# EAGLE design windowSensor (EAGLE 7.4.0)
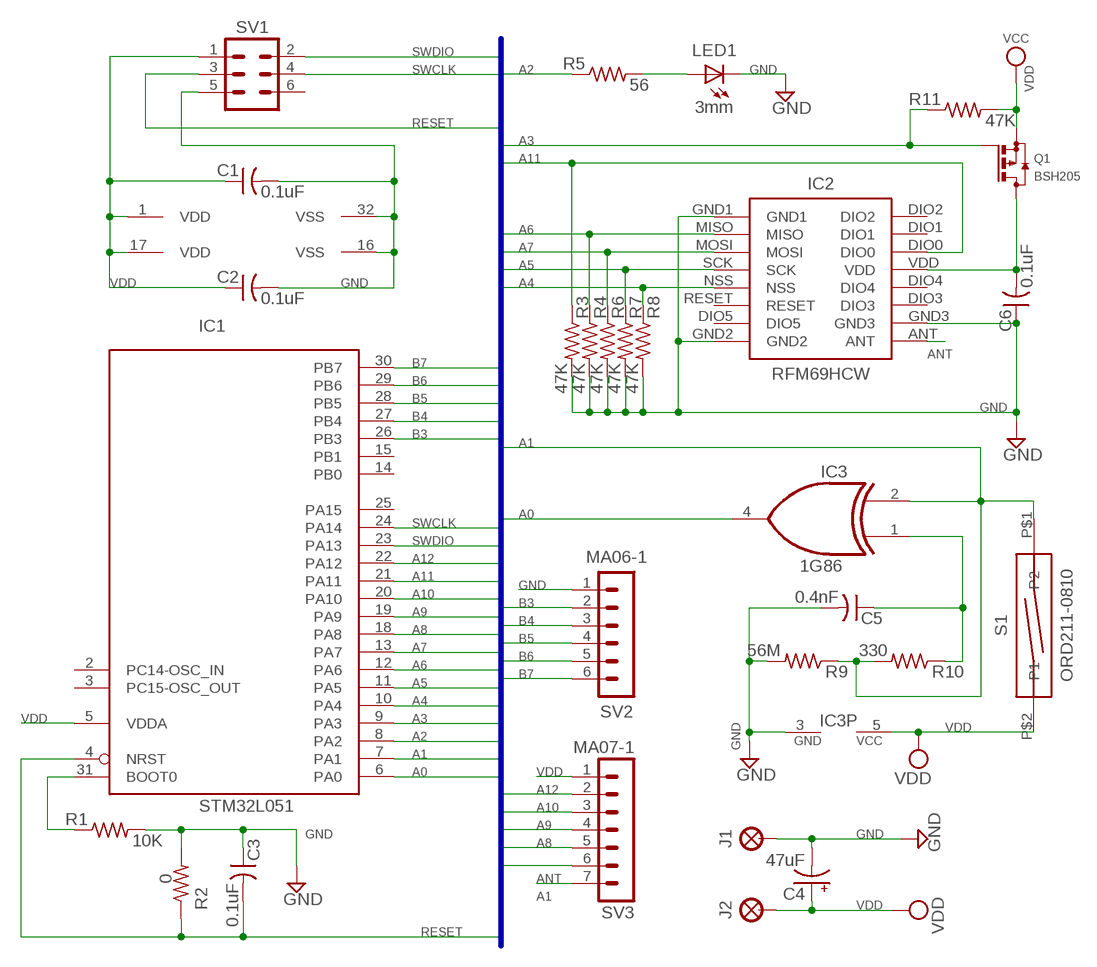
[diagram p0: schematic, sheet 1]

## Parts
C1  0.1uF  C-US0805  [C0805]
C2  0.1uF  C-US0805  [C0805]
C3  0.1uF  C-US0805  [C0805]
C4  47uF  CPOL-US0805  [CPOL0805]
C5  0.4nF  C-US0805  [C0805]
C6  0.1uF  C-US0805  [C0805]
IC1  STM32L051  STM32L051K6T  [LQFP32]
IC2  RFM69HCW  [RFM69HCW]
IC3  1G86  74AHC1G86DCK  [SC70-5]
J1  LSP30-LONG  [LSP30-LONG]
J2  LSP30-LONG  [LSP30-LONG]
LED1  3mm  LED3MM  [LED3MM]
Q1  BSH205  BSH205G2R  [SOT23]
R1  10K  R-US0805  [R0805]
R2  0  R-US0805  [R0805]
R3  47K  R-US0805  [R0805]
R4  47K  R-US0805  [R0805]
R5  56  R-US0805  [R0805]
R6  47K  R-US0805  [R0805]
R7  47K  R-US0805  [R0805]
R8  47K  R-US0805  [R0805]
R9  56M  R-US0805  [R0805]
R10  330  R-US0805  [R0805]
R11  47K  R-US0805  [R0805]
S1  ORD211-0810  [ORD211-0810]
SV1  SWD  MA03-2  [MA03-2]
SV2  MA06-1  [MA06-1-NO-PL]
SV3  MA07-1  MA07-1NO-PL  [MA07-1-NO-PL]

## Nets
A0: IC1.6(PA0) IC3.4(O)
A1: IC1.7(PA1) IC3.2(I1) R9.1 R10.2 S1.P$1(P2) SV3.6
A2: IC1.8(PA2) R5.1
A3: IC1.9(PA3) Q1.1(G) R11.1
A4: IC1.10(PA4) IC2.NSS R8.1
A5: IC1.11(PA5) IC2.SCK R7.1
A6: IC1.12(PA6) IC2.MISO R4.1
A7: IC1.13(PA7) IC2.MOSI R6.1
A8: IC1.18(PA8) SV3.5
A9: IC1.19(PA9) SV3.4
A10: IC1.20(PA10) SV3.3
A11: IC1.21(PA11) IC2.DIO0 R3.1
A12: IC1.22(PA12) SV3.2
A-BOOT: IC1.31(BOOT0) R1.1
ANT: IC2.ANT SV3.7
B3: IC1.26(PB3) SV2.2
B4: IC1.27(PB4) SV2.3
B5: IC1.28(PB5) SV2.4
B6: IC1.29(PB6) SV2.5
B7: IC1.30(PB7) SV2.6
GND: C1.2 C2.2 C3.1 C4.2-(-) C5.2 C6.1 IC1.16(VSS) IC1.32(VSS) IC2.GND1 IC2.GND2 IC2.GND3 IC3.3(GND) J1.MP LED1.K(C) R1.2 R2.2 R3.2 R4.2 R6.2 R7.2 R8.2 R9.2 SV1.5 SV2.1
N$4: LED1.A R5.2
N$22: C5.1 IC3.1(I0) R10.1
RESET: C3.2 IC1.4(NRST) R2.1 SV1.3
SD-VDD: C6.2 IC2.VDD Q1.3(D)
SWCLK: IC1.24(PA14) SV1.4
SWDIO: IC1.23(PA13) SV1.2
VDD: C1.1 C2.1 C4.1+(+) IC1.1(VDD) IC1.5(VDDA) IC1.17(VDD) IC3.5(VCC) J2.MP Q1.2(S) R11.2 S1.P$2(P1) SV1.1 SV3.1 ; supply symbol labelled VCC
Unconnected: IC1.2(PC14-OSC_IN) IC1.3(PC15-OSC_OUT) IC1.14(PB0) IC1.15(PB1) IC1.25(PA15) IC2.DIO1 IC2.DIO2 IC2.DIO3 IC2.DIO4 IC2.DIO5 IC2.RESET SV1.6

## Buses
A0,A1,A2,A3,A4,A5,A6,A7,A8,A9,A10,A11,A12,A13,A14,A15,B0,B1,B2,B3,B4,B5,B6,B7,RESET,SWDIO,SWCLK

## Library data of the parts
C1-C3 C5 C6 = MyComponents:C-US: SMD Multilayer Ceramic Capacitor; MOUSER: 80-C0805C104J5RAUTO
C4 = MyComponents:CPOL-US: SMT Tantalum Capacitor; MOUSER: 581-TAJR225K016RNJ
IC1 = stm32:STM32L051K*T: ARM 32-bit Cortex™-M0+ CPU 32 MHz maximum frequency 32 to 64 Kbytes of Flash memory 2 kbyte of Data EEPROM 8 kbytes of SRAM 27 GPIOs 1.8 to 3.6 V application supply; MOUSER: 511-STM32L051K6T6
IC2 = MyComponents:RFM69HCW: RFM69HCW transceiver module; MOUSER: 474-COM-13910
IC3 = 74xx-little-us:74*1G86: 2-input EXCLUSIV-OR gate
J1 J2 = MyComponents:LSP30-LONG: Long Solder Pad, drill 1 x 3 mm
LED1 = led:LED: LED OSRAM: - CHIPLED LG R971, LG N971, LY N971, LG Q971, LY Q971, LO R971, LY R971 LH N974, LH R974 LS Q976, LO Q976, LY Q976 LO Q996 - Hyper CHIPLED LW Q18S LB Q993, LB Q99A, LB R99A - SideLED LS A670, LO A670, LY A670, LG A670, LP A670 LB A673, LV A673, LT A673, LW A673 LH A674 LY A675 LS A676, LA A676, LO A676, LY A676, LW A676 LS A679, LY A679, LG A679 - Hyper Micro SIDELED® LS Y876, LA Y876, LO Y876, LY Y876 LT Y87S - SmartLED LW L88C, LW L88S LB L89C, LB L89S, LG L890 LS L89K, LO L89K, LY L89K LS L896, LA L896, LO L896, LY L896 - TOPLED LS T670, LO T670, LY T670, LG T670, LP T670 LSG T670, LSP T670, LSY T670, LOP T670, LYG T670 LG T671, LOG T671, LSG T671 LB T673, LV T673, LT T673, LW T673 LH T674 LS T676, LA T676, LO T676, LY T676, LB T676, LH T676, LSB T676, LW T676 LB T67C, LV T67C, LT T67C, LS T67K, LO T67K, LY T67K, LW E67C LS E67B, LA E67B, LO E67B, LY E67B, LB E67C, LV E67C, LT E67C LW T67C LS T679, LY T679, LG T679 LS T770, LO T770, LY T770, LG T770, LP T770 LB T773, LV T773, LT T773, LW T773 LH T774 LS E675, LA E675, LY E675, LS T675 LS T776, LA T776, LO T776, LY T776, LB T776 LHGB T686 LT T68C, LB T68C - Hyper Mini TOPLED® LB M676 - Mini TOPLED Santana® LG M470 LS M47K, LO M47K, LY M47K Source: http://www.osram.convergy.de LUXEON: - LUMILED® LXK2-PW12-R00, LXK2-PW12-S00, LXK2-PW14-U00, LXK2-PW14-V00 LXK2-PM12-R00, LXK2-PM12-S00, LXK2-PM14-U00 LXK2-PE12-Q00, LXK2-PE12-R00, LXK2-PE12-S00, LXK2-PE14-T00, LXK2-PE14-U00 LXK2-PB12-K00, LXK2-PB12-L00, LXK2-PB12-M00, LXK2-PB14-N00, LXK2-PB14-P00, LXK2-PB14-Q00 LXK2-PR12-L00, LXK2-PR12-M00, LXK2-PR14-Q00, LXK2-PR14-R00 LXK2-PD12-Q00, LXK2-PD12-R00, LXK2-PD12-S00 LXK2-PH12-R00, LXK2-PH12-S00 LXK2-PL12-P00, LXK2-PL12-Q00, LXK2-PL12-R00 Source: www.luxeon.com KINGBRIGHT: KA-3528ASYC Source: www.kingbright.com
Q1 = MyComponents:BSH205G2R: P-channel enhancement mode MOSFET (-2.3A); MOUSER: 771-BSH205G2R
R1-R11 = MyComponents:R-US: SMD Resistor; MOUSER: 660-RK73H2ATTDD1R00F
S1 = MyComponents:ORD211-0810: Reed switch; MOUSER: 876-ORD211-0810
SV1 = MyComponents:MA03-2: Headers & Wire Housing, 2 Row, 6 Position; MOUSER: 68602-406HLF
SV2 = MyComponents:MA06-1
SV3 = MyComponents:MA07-1: Headers & Wire Housing, 1 Row, 7 Position

## Board
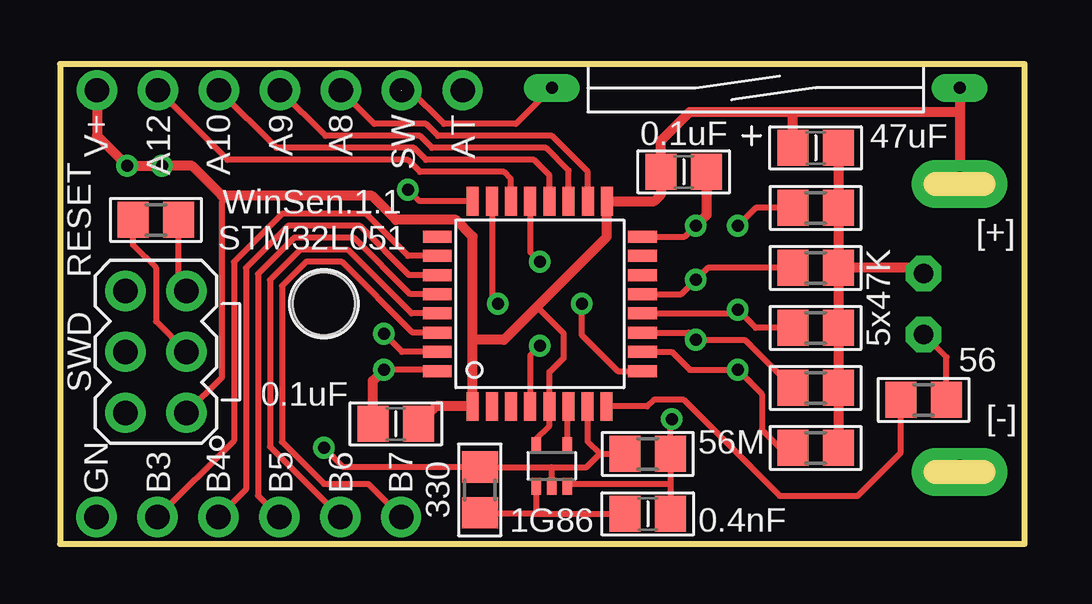
[diagram p1: board, top side]
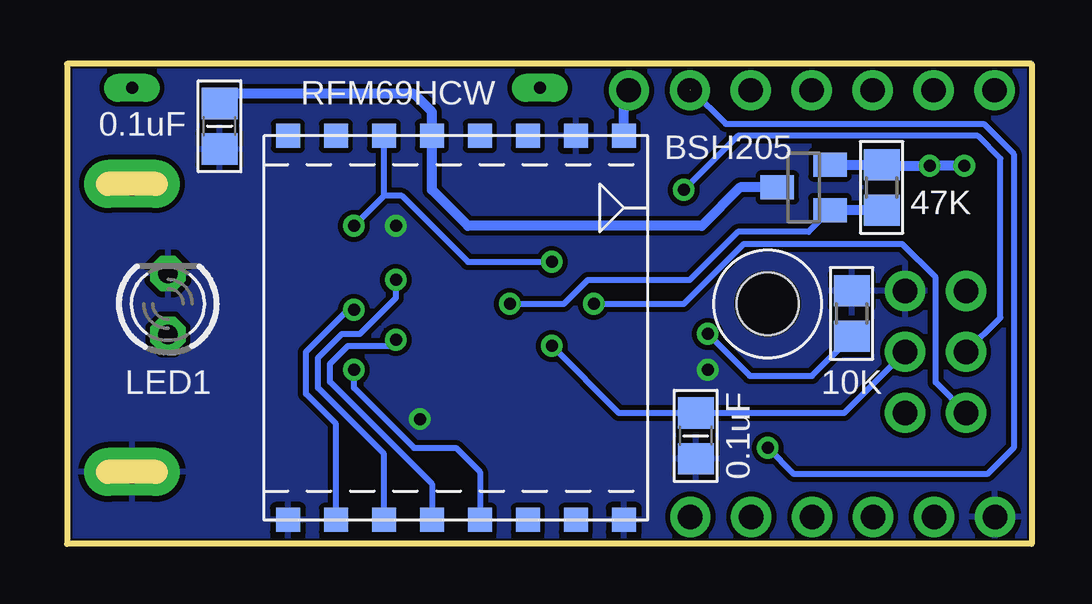
[diagram p2: board, bottom side, seen from below]

Size 40.2 x 20 mm. Coordinates in mm from the lower left corner, seen from the top.
Outline: 0,20 0,0 40.2,0 40.2,20 0,20
Copper layers (1*16): Top 0.035mm / dielectric 1.5mm / Bottom 0.035mm
Design rules "eagle *": minimum track width 10mil, minimum drill 19mil, track to track 8mil, track to pad 8mil, pad to pad 7mil, via to via 12mil, smd to smd 7mil, copper to edge 3mil, drill to drill 30mil, minimum pad ring 13mil, minimum via ring 8mil, stop-mask expansion 4mil, vias tented up to drill 0mil, thermal gap 10mil
Holes 2.6 mm at 11,10

### Footprints (pad centres in the part's own frame; a part is rotated, then mirrored left to right if it is on the bottom)
C0805 = smd 1.3 x 1.5: 1 -0.95,0; 2 0.95,0
CPOL0805 = smd 1.3 x 1.5: 1+ -0.95,0; 2- 0.95,0
LQFP32 = smd 0.5 x 1.2: 1 -2.8,-4.275; 2 -2,-4.275; 3 -1.2,-4.275; 4 -0.4,-4.275; 5 0.4,-4.275; 6 1.19,-4.275; 7 1.99,-4.275; 8 2.79,-4.275; 17 2.8,4.275; 18 2,4.275; 19 1.2,4.275; 20 0.4,4.275; 21 -0.4,4.275; 22 -1.2,4.275; 23 -2,4.275; 24 -2.8,4.275 | smd 1.2 x 0.5: 9 4.275,-2.8; 10 4.275,-2; 11 4.275,-1.2; 12 4.275,-0.4; 13 4.275,0.4; 14 4.275,1.2; 15 4.275,2; 16 4.275,2.8; 25 -4.275,2.8; 26 -4.275,2; 27 -4.275,1.2; 28 -4.275,0.4; 29 -4.275,-0.4; 30 -4.275,-1.2; 31 -4.275,-2; 32 -4.275,-2.8
RFM69HCW = smd 1 x 1: ANT 8,-7; DIO0 8,3; DIO1 8,5; DIO2 8,7; DIO3 8,-3; DIO4 8,-1; DIO5 -8,-5; GND1 -8,7; GND2 -8,-7; GND3 8,-5; MISO -8,5; MOSI -8,3; NSS -8,-1; RESET -8,-3; SCK -8,1; VDD 8,1
SC70-5 = smd 0.4 x 0.7: 1 -0.65,-0.85; 2 0,-0.85; 3 0.65,-0.85; 4 0.65,0.85; 5 -0.65,0.85
LSP30-LONG = drill 1 pad 2 long: MP 0,0
LED3MM = drill 0.813 octagon: A -1.27,0; K 1.27,0
SOT23 = smd 1 x 1.4: 1 -0.95,-1.1; 2 0.95,-1.1; 3 0,1.1
R0805 = smd 1.3 x 1.5: 1 -0.95,0; 2 0.95,0
ORD211-0810 = drill 0.5 pad 0.61 long: P$1 -8.5,0; P$2 8.5,0
MA03-2 = drill 1.016: 1 -2.54,-1.27; 2 -2.54,1.27; 3 0,-1.27; 4 0,1.27; 5 2.54,-1.27; 6 2.54,1.27
MA06-1-NO-PL = drill 1.016: 1 -6.35,0; 2 -3.81,0; 3 -1.27,0; 4 1.27,0; 5 3.81,0; 6 6.35,0
MA07-1-NO-PL = drill 1.016: 1 -7.62,0; 2 -5.08,0; 3 -2.54,0; 4 0,0; 5 2.54,0; 6 5.08,0; 7 7.62,0

### Placement (x,y rotation side)
C1  14,5 180 top
C2  26,15.5 0 top
C3  14,4.5 90 bottom
C4  31.5,16.5 0 top
C5  24.5,1.25 0 top
C6  33.85,17.4 90 bottom
IC1  20,10 0 top
IC2  24,9 90 bottom
IC3  20.5,3.25 0 top
J1  37.5,3 0 top
J2  37.5,15 0 top
LED1  36,10 90 bottom
Q1  9.5,14.85 90 bottom
R1  7.5,9.6 90 bottom
R2  4,13.5 0 top
R3  31.5,14 0 top
R4  31.5,9 0 top
R5  36,6 0 top
R6  31.5,11.5 0 top
R7  31.5,6.5 0 top
R8  31.5,4 0 top
R9  24.5,3.75 0 top
R10  17.5,2.25 90 top
R11  6.25,14.85 90 bottom
S1  29,19 0 top
SV1  4,8 90 top
SV2  7.87,1.12 0 top
SV3  9.16,18.9 0 top

### Tracks (layer width: path | path; a pad name or v marks a point on that pad's centre or on a via)
A0
  Top 0.254: IC3.4 21.15,5.68 IC1.6
A1  (via drill 0.5)  (1 unrouted)
  Top 0.254: 20.5,3.2 R10.2 11.8,3.2 v11,4 | 20.5,3.2 21.95,3.2 22.5,3.75 | 22.5,3.75 R9.1 | IC1.7 21.99,4.26 22.5,3.75 | IC3.2 20.5,3.2 | S1.P$1 19,17.5 16,17.5 14.6,18.9 SV3.6
  Bottom 0.254: 14.21,18.91 14.16,18.91 12.75,17.5 2,17.5 0.75,16.25 0.75,4 1.85,2.9 9.9,2.9 v11,4
A2
  Top 0.254: 35.05,5.8 R5.1 35.05,3.8 33.25,2 30,2 26,6 24.75,6 24.48,5.72 IC1.8 22.82,5.75
A3  (via drill 0.5 pad 0.61)
  Top 0.254: IC1.9 23.25,7.2 21.75,8.7 v21.75,10
  Bottom 0.254: Q1.1 9.3,13 12.25,13 14.25,11 18.5,11 19.5,10 v21.75,10
  Bottom 0.406: R11.1 Q1.1
A4  (via drill 0.5)
  Top 0.254: R8.1 30,4 29.25,4.75 29.25,6.25 v28.25,7.25 26.25,7.25 25.5,8 IC1.10
  Bottom 0.254: v28.25,7.25 28.25,6.5 25.75,4 24,4 23,3 IC2.NSS
A5  (via drill 0.5)
  Top 0.254: IC1.11 26.2,8.8 v26.5,8.5 28.55,8.5 R7.1
  Bottom 0.254: 25.25,1 IC2.SCK 25,2.5 29.25,6.75 29.25,7.5 28.5,8.25 26.75,8.25 v26.5,8.5
A6  (via drill 0.5)
  Top 0.254: IC1.12 28.1,9.6 v28.25,9.75 29,9 R4.1
  Bottom 0.254: IC2.MISO 29,5 30.25,6.25 30.25,8 28.5,9.75 v28.25,9.75
A7  (via drill 0.5)
  Top 0.254: IC1.13 25.9,10.4 v26.5,11 27,11.5 R6.1
  Bottom 0.254: IC2.MOSI 27,3.75 29.75,6.5 29.75,7.75 28.75,8.75 28,8.75 26.5,10.25 v26.5,11
A8
  Top 0.254: IC1.18 22,15.5 20.5,17 15.75,17 15.25,17.5 13.1,17.5 SV3.5
A9
  Top 0.254: IC1.19 21.2,15.55 20.25,16.5 15.5,16.5 15,17 11.06,17 SV3.4
A10
  Top 0.254: IC1.20 20.4,15.35 19.75,16 15.25,16 14.75,16.5 9.02,16.5 SV3.3
A11  (via drill 0.5)
  Top 0.254: R3.1 29,14 v28.25,13.25 | IC1.21 19.6,12.15 v20,11.75
  Bottom 0.254: 27,14.5 IC2.DIO0 | 27,14.5 v28.25,13.25 | 27,14.5 26.25,14.5 23.5,11.75 v20,11.75
A12
  Top 0.254: IC1.22 18.8,15.2 18.5,15.5 15,15.5 14.5,16 6.98,16 SV3.2
A-BOOT  (via drill 0.5)
  Top 0.254: IC1.31 14.25,8 v13.5,8.75
  Bottom 0.254: v13.5,8.75 11.75,7 9.15,7 R1.1
ANT
  Bottom 0.406: IC2.ANT 17,18.68 SV3.7
B3
  Top 0.254: IC1.26 14.5,12 12.75,13.75 9.25,13.75 7.25,11.75 7.25,4.31 SV2.2
B4
  Top 0.254: IC1.27 14.55,11.2 12.5,13.25 9.5,13.25 7.75,11.5 7.75,2.27 SV2.3
B5
  Top 0.254: IC1.28 14.6,10.4 12.25,12.75 9.75,12.75 8.25,11.25 8.25,2.01 SV2.4
B6
  Top 0.254: IC1.29 14.65,9.6 12,12.25 10,12.25 8.75,11 8.75,4.05 SV2.5
B7
  Top 0.254: IC1.30 14.7,8.8 11.75,11.75 10.25,11.75 9.25,10.75 9.25,4.25 11,2.5 12.84,2.5 SV2.6
GND  (via drill 0.5)
  Top 0.254: SV1.5 4.95,10.86 R2.2 | 26.95,14.95 C2.2 | IC1.16 26.05,12.8 v26.5,13.25 | 25.45,2.5 R9.2 25.45,5.2 v25.5,5.2 | 25.45,2.5 C5.2 | IC3.3 21.15,2.5 25.45,2.5 | IC1.32 15.68,7.25 v13.5,7.25
  Top 0.406: 26.95,14.95 26.95,13.7 v26.5,13.25 | R6.2 R3.2 C4.2- | R6.2 R4.2 R7.2 R8.2 | LED1.K 35.77,11.5 R6.2 | C1.2 13.05,6.8 v13.5,7.25
  pour Bottom: 0,20 0,0 40,0 40,20
N$4
  Top 0.254: R5.2 36.95,7.78 LED1.A
N$22
  Top 0.254: 19.75,1.25 C5.1 | IC3.1 19.85,1.35 arc-90 19.75,1.25 | 19.75,1.25 17.75,1.25 17.55,1.25 R10.1
  Top 0.406: 17.8,1.25 17.75,1.25
RESET  (via drill 0.5)
  Top 0.254: SV1.3 4,9.27 4,11.5 3.05,12.45 R2.1 | v20,8.25 19.6,7.85 IC1.4
  Bottom 0.254: SV1.3 7.82,5.45 C3.2 17.2,5.45 v20,8.25
SD-VDD
  Bottom 0.406: C6.2 33.45,18.75 25.75,18.75 25,18 IC2.VDD 25,14.75 23.5,13.25 13.75,13.25 12.15,14.85 Q1.3
SWCLK  (via drill 0.5)
  Top 0.254: IC1.24 14.97,14.28 v14.5,14.75
  Bottom 0.254: SV1.4 1.3,9.43 1.3,16.05 2.25,17 12.25,17 v14.5,14.75
SWDIO  (via drill 0.5)
  Top 0.254: IC1.23 18,10.25 v18.25,10
  Bottom 0.254: SV1.2 4,6.73 4,11.1 5.4,12.5 12,12.5 14.5,10 v18.25,10
VDD  (via drill 0.5 pad 0.61)
  Top 0.254: IC3.5 19.85,4.35 20.4,4.9 IC1.5 20.4,7.15 21,7.75 21,8.75 19.88,9.88 | SV1.1 6.75,6.94 6.75,14.25 7,14.5
  Top 0.406: S1.P$2 37.5,18 | 37.5,18 J2.MP | C2.1 25.05,16.8 26.25,18 30.5,18 | 30.5,18 37.5,18 | C4.1+ 30.55,17.95 30.5,18 | C2.1 25.05,15.05 | 17.2,8.5 IC1.1 15.68,5.72 C1.1 | 17.2,8.5 17.2,12.8 16.5,13.5 14,13.5 13,14.5 7,14.5 6.75,14.5 5.5,15.75 v4.25,15.75 v2.8,15.75 1.54,17.01 SV3.1 | 17.2,8.5 18.5,8.5 19.88,9.88 22.8,12.8 IC1.17 24.77,14.28 25.05,14.55 C2.1
  Bottom 0.406: v2.8,15.75 v4.25,15.75 6.2,15.75 R11.2 Q1.2

### Text on the board
tNames: V+ | A12 | A10 | A9 | A8 | SW | AT | RESET | WinSen.1.1 | [+] | 5x47K | [-] | GN | B3 | B4 | B5 | B6 | B7